# Altium schematic sheet modFOC-Sensing.SchDoc: modFOC-Sensing
size A4; Author: Mathias Giller; CompanyName: HTL St. Pölten; Address1: modFOC; DocumentNumber: 4; Revision: 2.0; SheetNumber: 4; SheetTotal: 7
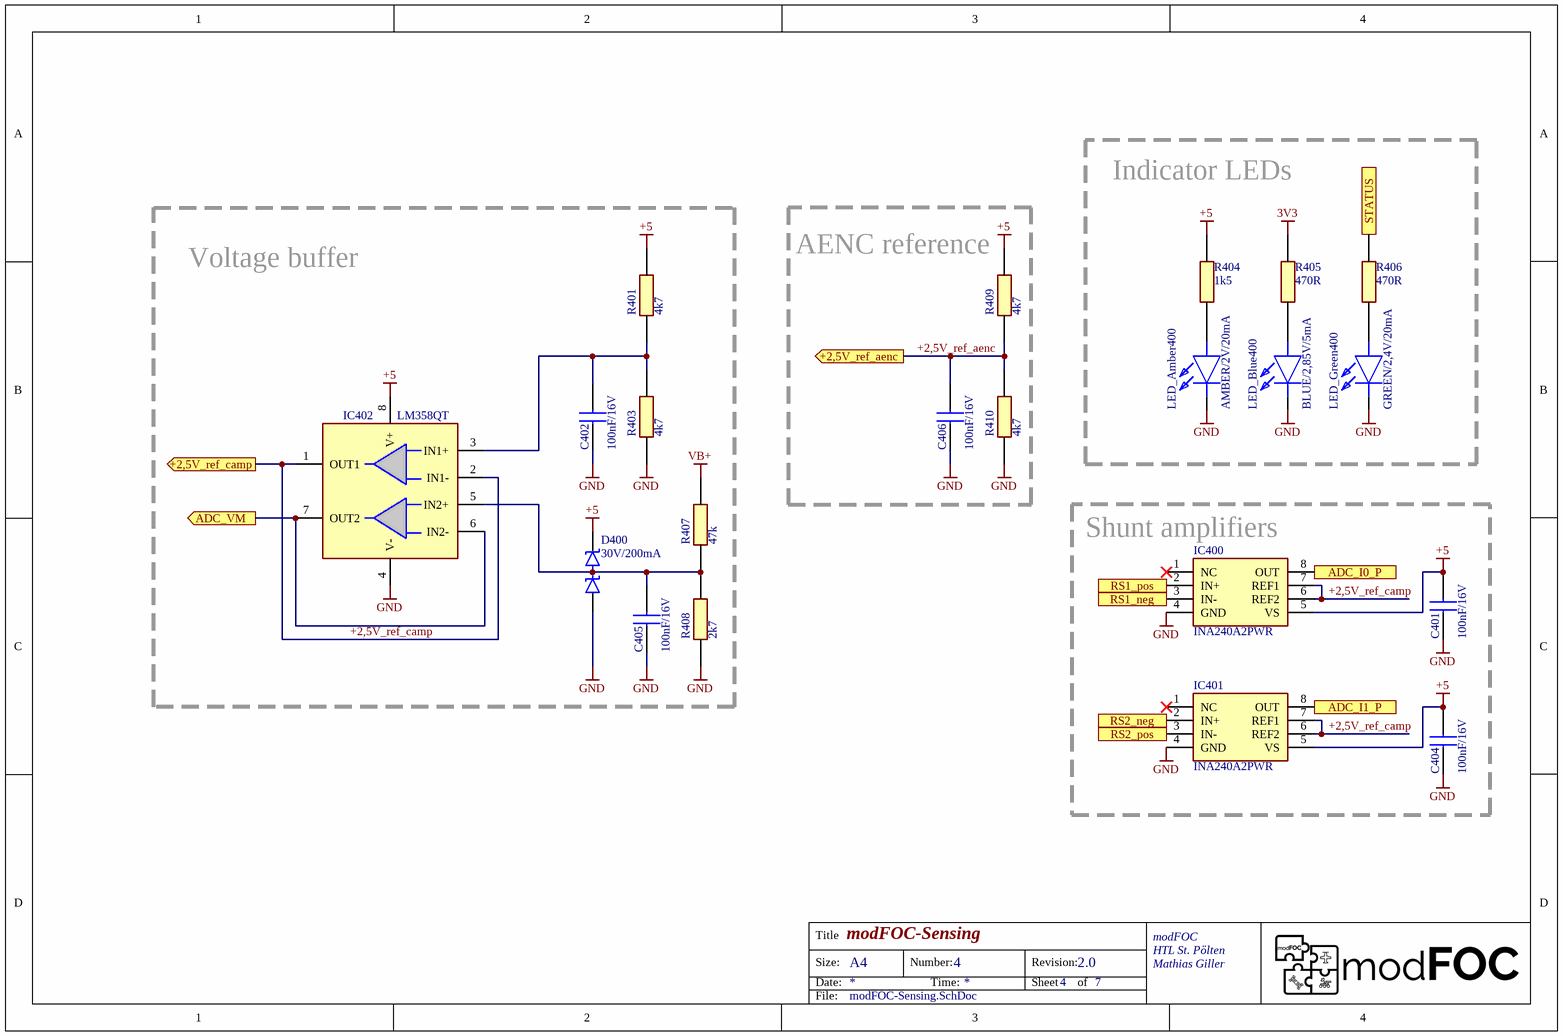
[diagram p0: modFOC-Sensing.SchDoc]

## Parts
C401  100nF/16V  [CAPC1608X97N]
C402  100nF/16V  [CAPC1608X97N]
C404  100nF/16V  [CAPC1608X97N]
C405  100nF/16V  [CAPC1608X97N]
C406  100nF/16V  [CAPC1608X97N]
D400  30V/200mA  [SOT95P240X110-3N]
IC400  INA240A2PWR  [SOP65P640X120-8N]
IC401  INA240A2PWR  [SOP65P640X120-8N]
IC402  LM358QT  [SON50P200X200X60-9N-D]
LED_Amber400  AMBER/2V/20mA  [LEDC1608X55N]
LED_Blue400  BLUE/2,85V/5mA  [LEDC1608X40N]
LED_Green400  GREEN/2,4V/20mA  [LGQ396PS35]
R401  4k7  [RESC1608X55N]
R403  4k7  [RESC1608X55N]
R404  1k5  [RESC1608X55N]
R405  470R  [RESC1608X55N]
R406  470R  [RESC1608X55N]
R407  47k  [RESC1608X55N]
R408  2k7  [RESC1608X55N]
R409  4k7  [RESC1608X55N]
R410  4k7  [RESC1608X55N]

## Blocks framed on the sheet
Indicator LEDs: LED_Amber400 LED_Blue400 LED_Green400 R404-R406
Voltage buffer: C402 C405 D400 IC402 R401 R403 R407 R408
AENC reference: C406 R409 R410
Shunt amplifiers: C401 C404 IC400 IC401

## Ports
+2,5V_ref_aenc (out), +2,5V_ref_camp (out), ADC_I0_P (out), ADC_I1_P (out), ADC_VM (out), RS1_neg (in), RS1_pos (in), RS2_neg (in), RS2_pos (in), STATUS (in)

## Nets
3V3: R405.1
+5: C401.2 C404.2 D400.2(K) IC400.5(VS) IC401.5(VS) IC402.8(V+) R401.2 R404.1 R409.2
GND: C401.1 C402.1 C404.1 C405.1 C406.1 D400.1(A) IC400.4(GND) IC401.4(GND) IC402.4(V-) LED_Amber400.1(K) LED_Blue400.1(K) LED_Green400.1(K) R403.1 R408.2 R410.1
VB+: R407.1
+2,5V_ref_aenc: C406.2 R409.1 R410.2 ; port +2,5V_ref_aenc
+2,5V_ref_camp: IC400.6(REF2) IC400.7(REF1) IC401.6(REF2) IC401.7(REF1) IC402.1(OUT1) IC402.2(IN1-) ; port +2,5V_ref_camp
ADC_I0_P: IC400.8(OUT) ; port ADC_I0_P
ADC_I1_P: IC401.8(OUT) ; port ADC_I1_P
ADC_VM: IC402.6(IN2-) IC402.7(OUT2) ; port ADC_VM
RS1_neg: IC400.3(IN-) ; port RS1_neg
RS1_pos: IC400.2(IN+) ; port RS1_pos
RS2_neg: IC401.2(IN+) ; port RS2_neg
RS2_pos: IC401.3(IN-) ; port RS2_pos
STATUS: R406.1 ; port STATUS
NetC402_2: C402.2 IC402.3(IN1+) R401.1 R403.2
NetC405_2: C405.2 D400.3(A/K) IC402.5(IN2+) R407.2 R408.1
NetLED_Amber400_2: LED_Amber400.2(A) R404.2
NetLED_Blue400_2: LED_Blue400.2(A) R405.2
NetLED_Green400_2: LED_Green400.2(A) R406.2

Not connected (* = marked no-connect by the designer): IC400 1(NC)*; IC401 1(NC)*

## Notes on the sheet
- (near IC400) Inputs inverted to aid PCB layout
- Title
- Size:
- Date:
- A4
- Number:
- Time:
- Revision:
- Sheet
- of
- File:

## Library data of the parts
C401 C402 C404-C406 = C0603: Capacitor
D400 = BAT54S: Schottky Diode; Manufacturer_Name: Rectron; Datasheet Link: https://www.rectron.com/data_sheets/bat54s.pdf; Height: 1.1mm; Manufacturer_Part_Number: BAT54S; Mouser Part Number: 583-BAT54S; Mouser Price/Stock: https://www.mouser.co.uk/ProductDetail/Rectron/BAT54S?qs=7pEAo90IqNGRiqD7TkybWA%3D%3D; Arrow Part Number: BAT54S; Arrow Price/Stock: https://www.arrow.com/en/products/bat54s/rectron
IC400 IC401 = INA240A2PWR: Current shunt amp; Manufacturer_Name: Texas Instruments; Manufacturer_Part_Number: INA240A4PWR; Datasheet Link: http://www.ti.com/lit/ds/symlink/ina240.pdf; Height: 1.2mm; Mouser Part Number: 595-INA240A4PWR; Mouser Price/Stock: https://www.mouser.co.uk/ProductDetail/Texas-Instruments/INA240A4PWR?qs=aVyJF2WnouQ31PAZ9p0r8w%3D%3D; Arrow Part Number: INA240A4PWR; Arrow Price/Stock: https://www.arrow.com/en/products/ina240a4pwr/texas-instruments?region=nac
IC402 = LM358QT: Le' Megaslow 358; Manufacturer_Name: STMicroelectronics; Datasheet Link: https://componentsearchengine.com/Datasheets/1/LM358QT.pdf; Height: 0.6mm; Manufacturer_Part_Number: LM358QT; Mouser Part Number: 511-LM358QT; Mouser Price/Stock: https://www.mouser.co.uk/ProductDetail/STMicroelectronics/LM358QT?qs=GkDVaEP5dcs4xwTXUtddog%3D%3D; Arrow Part Number: LM358QT; Arrow Price/Stock: https://www.arrow.com/en/products/lm358qt/stmicroelectronics?region=nac
LED_Amber400 = ASMT-RA45-AP932: LED; Manufacturer_Name: Avago Technologies; Datasheet Link: https://docs.broadcom.com/docs/AV02-0378EN; Height: 0.55mm; Manufacturer_Part_Number: ASMT-RA45-AP932; Mouser Part Number: 630-ASMT-RA45-AP932; Mouser Price/Stock: https://www.mouser.co.uk/ProductDetail/Broadcom-Avago/ASMT-RA45-AP932?qs=7zQgkplsu%2FO5gZneoB42ug%3D%3D
LED_Blue400 = LB_Q39G-L2OO-35-1: LED; Manufacturer_Name: OSRAM; Manufacturer_Part_Number: LB Q39G-L2OO-35-1; Datasheet Link: http://www.mouser.com/ds/2/311/LB Q39G - CHIPLED 0603-553388.pdf; Height: 0.4mm; Mouser Part Number: 720-LBQ39GL2N2351; Mouser Price/Stock: https://www.mouser.co.uk/ProductDetail/OSRAM-Opto-Semiconductors/LB-Q39G-L2OO-35-1?qs=74fRo9GAWsxvZBH6a5xY%252BA%3D%3D; Arrow Part Number: LB Q39G-L2OO-35-1; Arrow Price/Stock: https://www.arrow.com/en/products/lbq39g-l2oo-35-1/osram-opto-semiconductors
LED_Green400 = LG_Q396-PS-35: LED Green; Manufacturer_Name: OSRAM; Manufacturer_Part_Number: LG Q396-PS-35; Datasheet Link: https://mouser.componentsearchengine.com/Datasheets/2/LG%20Q396-PS-35.pdf; Height: 0.4mm; Mouser Part Number: 720-LGQ396A3964; Mouser Price/Stock: https://www.mouser.co.uk/ProductDetail/OSRAM-Opto-Semiconductors/LG-Q396-PS-35?qs=xC%252BE9h5iuX5%252BCocujXxOpw%3D%3D; Arrow Part Number: LG Q396-PS-35; Arrow Price/Stock: https://www.arrow.com/en/products/lgq396-ps-35/osram-opto-semiconductors
R401 R403-R410 = R0603: Resistor